# EasyEDA schematic SCH_uCurrent_2024-10-28.json
TITLE: Ucurrent; REV: 1.0; Date: 2024-10-15; Sheet: 1/1; Drawn By: Brayan-Jeifer; Company: UIS
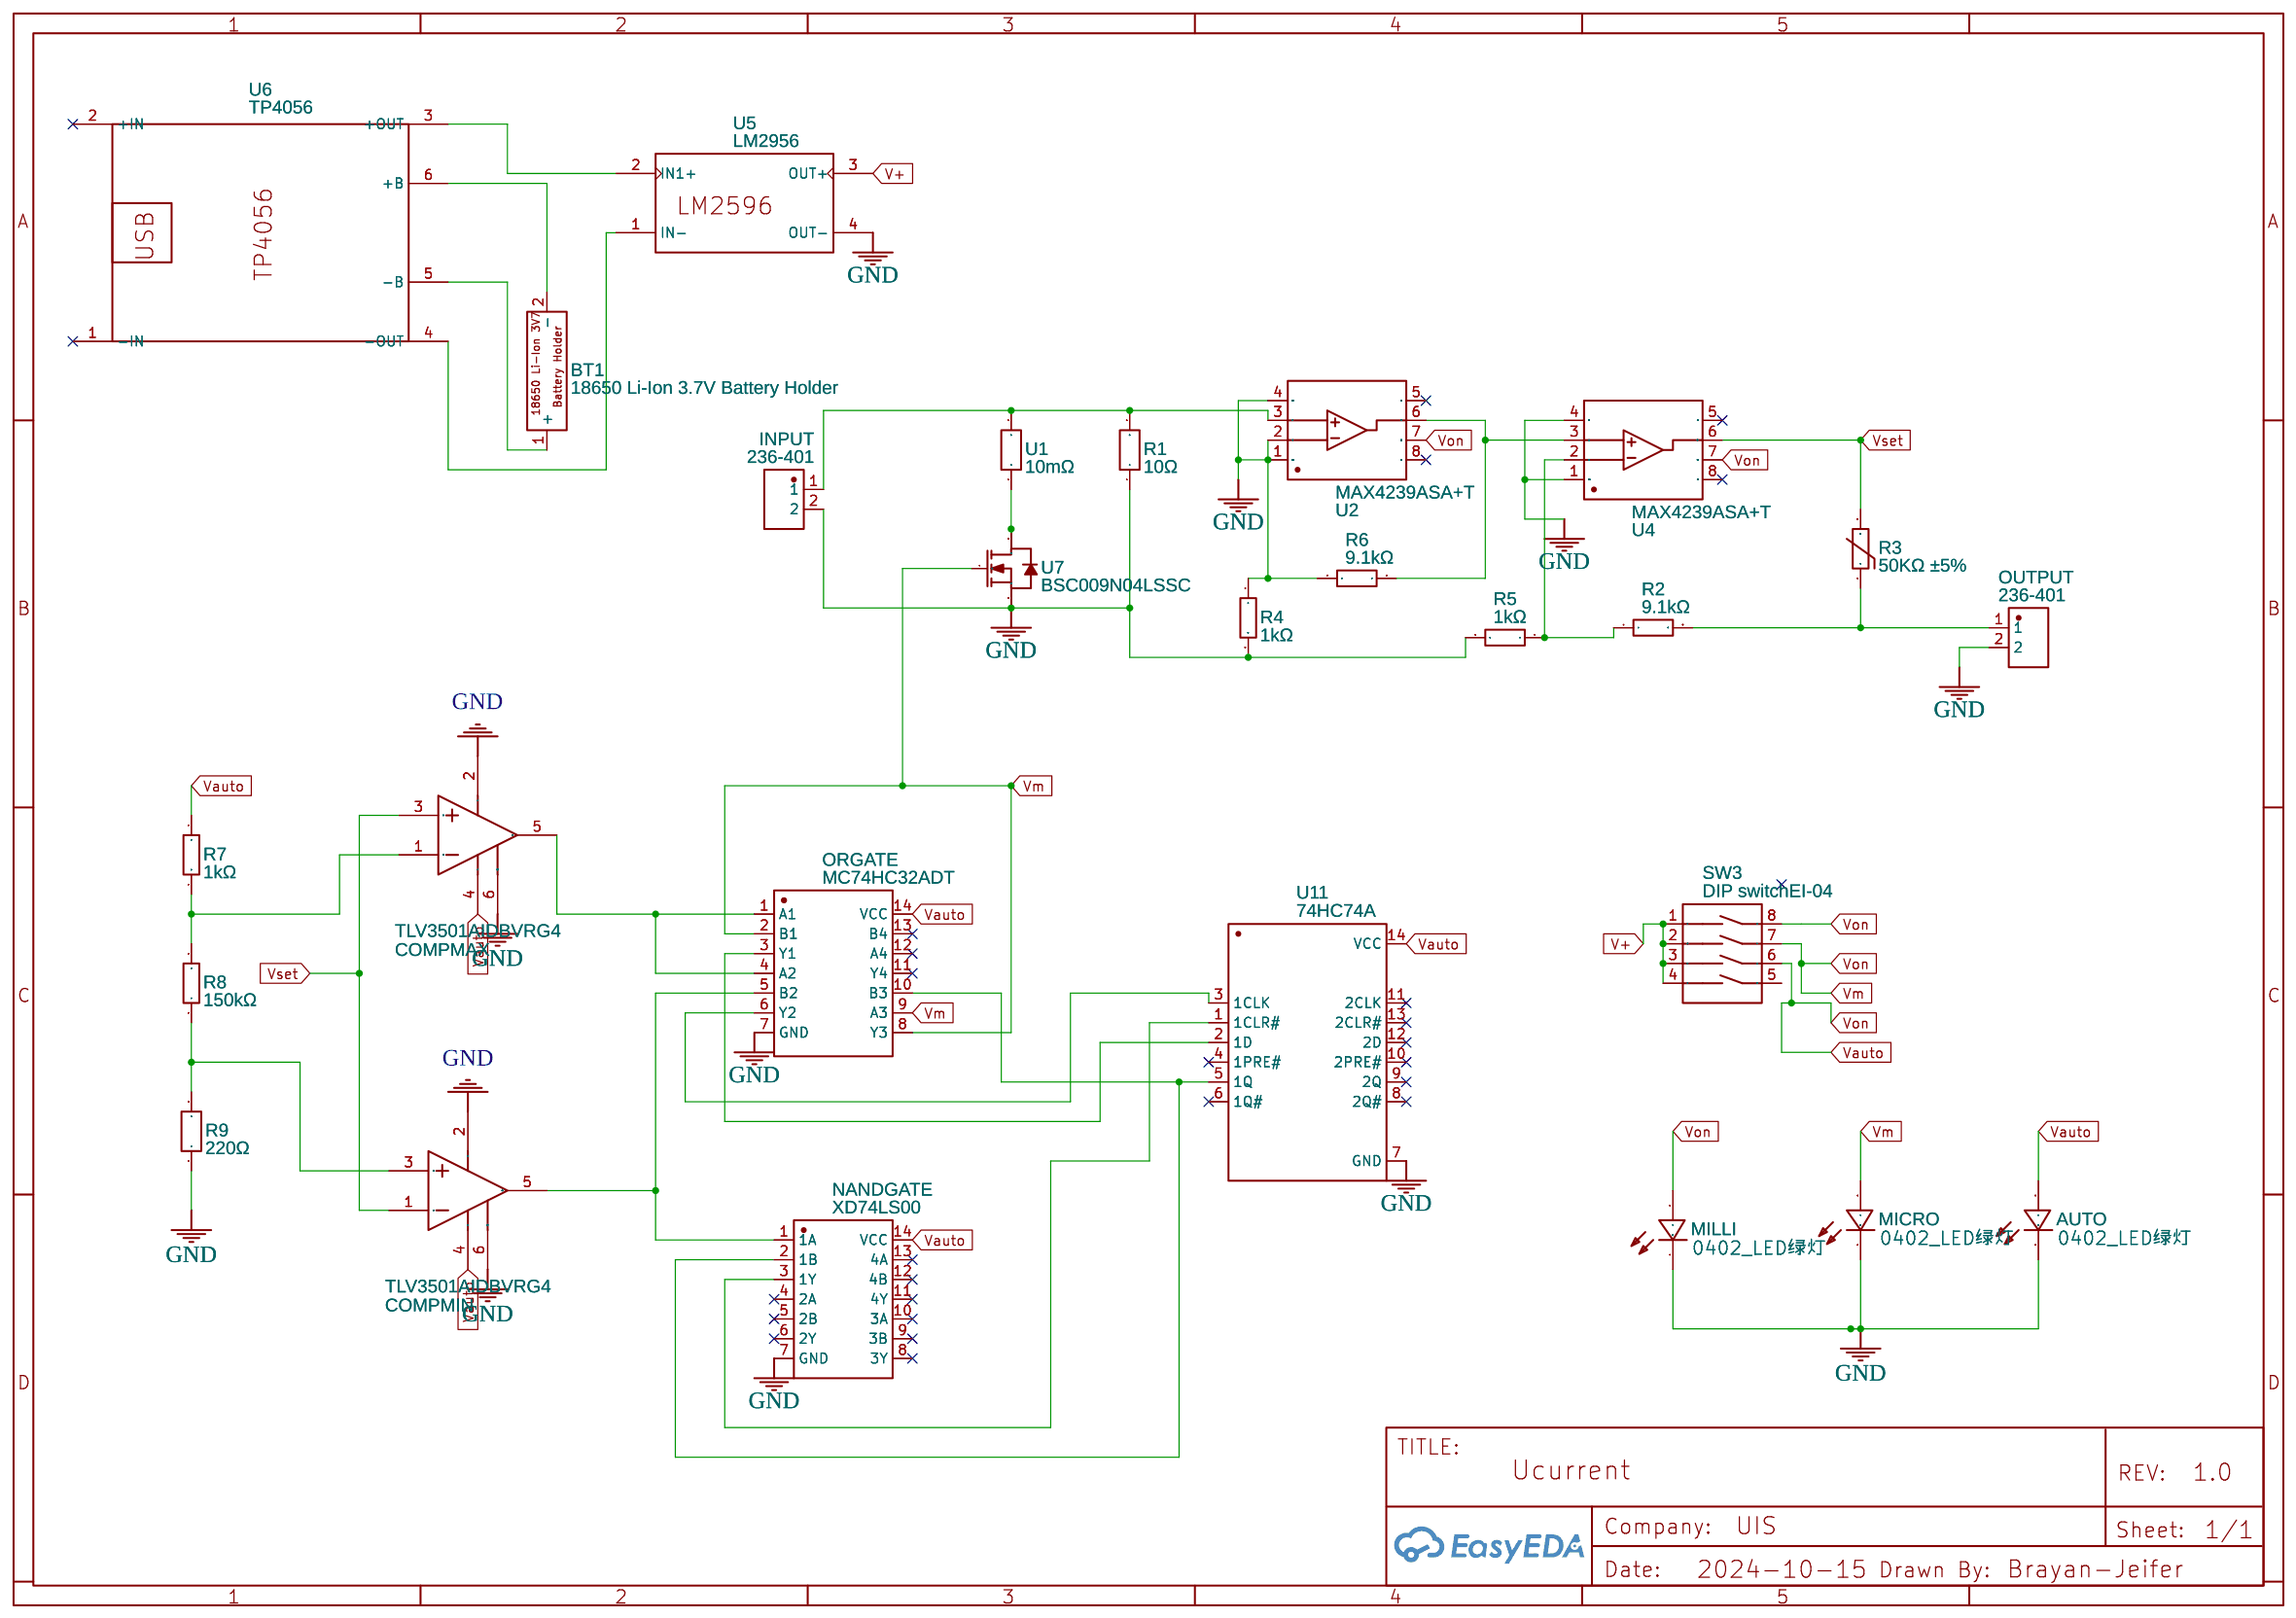
[diagram p0: schematic sheet]

## Parts
AUTO  0402_LED绿灯  [LED0402-RD_GREEN]
BT1  18650 Li-Ion 3.7V Battery Holder  [18650 LI-ION 3.7V BATTERY HOLDER]
COMPMAX  TLV3501AIDBVRG4  [SOT-23-6_L2.9-W1.6-P0.95-LS2.8-BR]
COMPMIN  TLV3501AIDBVRG4  [SOT-23-6_L2.9-W1.6-P0.95-LS2.8-BR]
INPUT  236-401  [CONN-TH_WAGO-236-401]
MICRO  0402_LED绿灯  [LED0402-RD_GREEN]
MILLI  0402_LED绿灯  [LED0402-RD_GREEN]
NANDGATE  XD74LS00  [DIP-14_L20.0-W7.6-P2.54-LS7.6-BL]
ORGATE  MC74HC32ADT  [TSSOP-14_L5.0-W4.4-P0.65-LS6.4-BL]
OUTPUT  236-401  [CONN-TH_WAGO-236-401]
R1  10Ω  [R0805]
R2  9.1kΩ  [R1206]
R3  50KΩ ±5%  [RES-TH_L2.5-W2.5-P1.70-D0.3]
R4  1kΩ  [R1206]
R5  1kΩ  [R1206]
R6  9.1kΩ  [R1206]
R7  1kΩ  [R1206]
R8  150kΩ  [R0201]
R9  220Ω  [R0805]
SW3  DIP switchEI-04  [SW-TH_DIPSWITCHEI-04]
U1  10mΩ  [R2512]
U2  MAX4239ASA+T  [SOIC-8_L5.0-W4.0-P1.27-LS6.0-BL]
U4  MAX4239ASA+T  [SOIC-8_L5.0-W4.0-P1.27-LS6.0-BL]
U5  LM2956  [LM2596]
U6  TP4056  [TP4056PCB]
U7  BSC009N04LSSC  [PG-WSON-8_L5.0-W6.0-P1.27-BL-EP]
U11  74HC74A  [SOIC-14_L8.6-W3.8-P1.27-LS6.0-BL]

## Library data of the parts
AUTO MICRO MILLI = 0402_LED绿灯: Contributor: LCSC; Supplier: LCSC; Supplier Part: C9900005854; Manufacturer: null
BT1 = 18650 Li-Ion 3.7V Battery Holder: Manufacturer: Smartcube; Manufacturer Part: 18650_Li_BT_3P7V; Supplier Part: 18650_Li_BT_3P7V; Contributor: smufeed
COMPMAX COMPMIN = TLV3501AIDBVRG4: Contributor: lcsc; Supplier: LCSC; Supplier Part: C3658928; Manufacturer: TI(德州仪器); JLCPCB Part Class: Extended Part
INPUT OUTPUT = 236-401: Supplier: LCSC; Supplier Part: C3817233; Manufacturer: WAGO(万可); JLCPCB Part Class: Extended Part; Contributor: lcsc
NANDGATE = XD74LS00: Contributor: LCSC; Supplier: LCSC; Supplier Part: C556265; Manufacturer: XINLUDA(信路达); JLCPCB Part Class: Extended Part
ORGATE = MC74HC32ADT: Contributor: lcsc; Supplier: LCSC; Supplier Part: C4469193; Manufacturer: onsemi(安森美)
R1 = CRCW080510R0FKEA: Contributor: LCSC; Supplier: LCSC; Supplier Part: C844938; Manufacturer: VISHAY(威世); JLCPCB Part Class: Extended Part
R2 R6 = RC1206JR-079K1L: Contributor: LCSC; Supplier: LCSC; Supplier Part: C246076; Manufacturer: YAGEO(国巨); JLCPCB Part Class: Extended Part
R3 = 50KΩ ±5%: Contributor: LCSC; Supplier: LCSC; Supplier Part: C123381; Manufacturer: 时恒; Manufacturer Part: MF52A503J3950 (A1); JLCPCB Part Class: Extended Part
R4 R5 R7 = CR-06FL7----1K: Contributor: LCSC; Supplier: LCSC; Supplier Part: C280023; Manufacturer: Viking(光颉); JLCPCB Part Class: Extended Part
R8 = 0201WMF1503TCE: Contributor: LCSC; Supplier: LCSC; Supplier Part: C246985; Manufacturer: UNI-ROYAL(厚声)
R9 = 0805W8D2200T5E: Contributor: LCSC; Supplier: LCSC; Supplier Part: C407469; Manufacturer: UNI-ROYAL(厚声); JLCPCB Part Class: Extended Part
SW3 = DIP switchEI-04: Supplier: LCSC; Manufacturer: 圜达; Manufacturer Part: 拨码开关EI-04; Supplier Part: C99987; JLCPCB Part Class: Extended Part
U1 = WSL2512R0100FEA: Contributor: LCSC; Supplier: LCSC; Supplier Part: C844901; Manufacturer: VISHAY(威世); JLCPCB Part Class: Extended Part
U2 U4 = MAX4239ASA+T: Contributor: LCSC; Supplier: LCSC; Supplier Part: C2060622; Manufacturer: ADI(亚德诺)/MAXIM(美信); JLCPCB Part Class: Extended Part
U5 = LM2956: Supplier: LCSC; Contributor: sakshi.20jiee013
U6 = TP4056: Manufacturer: Handsontec; link: https://my.cytron.io/p-lithium-battery-tp4056-1a-usb-c-charger-with-protection?r=1&gclid=Cj0KCQjw6J-SBhCrARIsAH0yMZiaYN5HkATqRNo5ND55wja1uoi7LssL6G28tussGWknd_TQ-4KjQf4aAo-UEALw_wcB; Contributor: utbahR
U7 = BSC009N04LSSC: Contributor: prarthitj
U11 = 74HC74A: Supplier: LCSC; Supplier Part: C6089304; Manufacturer: onsemi(安森美); Contributor: lcsc; JLCPCB Part Class: Extended Part

## Nets
GND: AUTO.1(C) COMPMAX.2(V-) COMPMAX.6(SHDN) COMPMIN.2(V-) COMPMIN.6(SHDN) INPUT.2 MICRO.1(C) MILLI.1(C) NANDGATE.7(GND) ORGATE.7(GND) OUTPUT.2 R1.1 R4.1 R4.2 R5.2 R6.1 R9.1 U2.1(SHDN#) U2.2(IN-) U2.4(GND) U4.1(SHDN#) U4.4(GND) U5.4(OUT-) U7.1(S) U7.2(S) U7.3(S) U11.7(GND)
V+: SW3.1 SW3.2 SW3.3 SW3.4 U5.3(OUT+)
Vauto: AUTO.2(A) COMPMAX.4(V+) COMPMIN.4(V+) MICRO.2(A) MILLI.2(A) NANDGATE.14(VCC) ORGATE.2(B1) ORGATE.8(Y3) ORGATE.9(A3) ORGATE.14(VCC) R7.1 SW3.6 SW3.7 SW3.8 U2.7(VCC) U4.7(VCC) U7.4(G) U11.14(VCC)
Vset: COMPMAX.3(+IN) COMPMIN.1(-IN) R3.2 U4.6(OUT)
Net-(BT1-1): BT1.1(+) U6.5(-B)
Net-(BT1-2): BT1.2(-) U6.6(+B)
Net-(COMPMAX-1): COMPMAX.1(-IN) R7.2 R8.2
Net-(COMPMAX-5): COMPMAX.5(OUT) ORGATE.1(A1) ORGATE.4(A2)
Net-(COMPMIN-3): COMPMIN.3(+IN) R8.1 R9.2
Net-(COMPMIN-5): COMPMIN.5(OUT) NANDGATE.1(1A) ORGATE.5(B2)
Net-(INPUT-1): INPUT.1 R1.2 U1.2 U2.3(IN+)
Net-(NANDGATE-2): NANDGATE.2(1B) ORGATE.10(B3) U11.5(1Q)
Net-(NANDGATE-3): NANDGATE.3(1Y) U11.1(1CLR#)
Net-(ORGATE-3): ORGATE.3(Y1) U11.2(1D)
Net-(ORGATE-6): ORGATE.6(Y2) U11.3(1CLK)
Net-(OUTPUT-1): OUTPUT.1 R2.2 R3.1
Net-(R2-1): R2.1 R5.1 U4.2(IN-)
Net-(R6-2): R6.2 U2.6(OUT) U4.3(IN+)
Net-(U1-1): U1.1 U7.5(D) U7.6(D) U7.7(D) U7.8(D)
Net-(U5-1): U5.1(IN-) U6.4(-OUT)
Net-(U5-2): U5.2(IN1+) U6.3(+OUT)

Not connected (* = marked no-connect by the designer): NANDGATE 4(2A)* 5(2B)* 6(2Y)* 8(3Y)* 9(3B)* 10(3A)* 11(4Y)* 12(4B)* 13(4A)*; ORGATE 11(Y4)* 12(A4)* 13(B4)*; SW3 5; U2 5(NC)* 8(NC)*; U4 5(NC)* 8(NC)*; U6 1(-IN)* 2(+IN)*; U11 4(1PRE#)* 6(1Q#)* 8(2Q#)* 9(2Q)* 10(2PRE#)* 11(2CLK)* 12(2D)* 13(2CLR#)*
